# Altium schematic sheet Level_Shifter.SchDoc
size A4; SheetNumber: 9; SheetTotal: 11
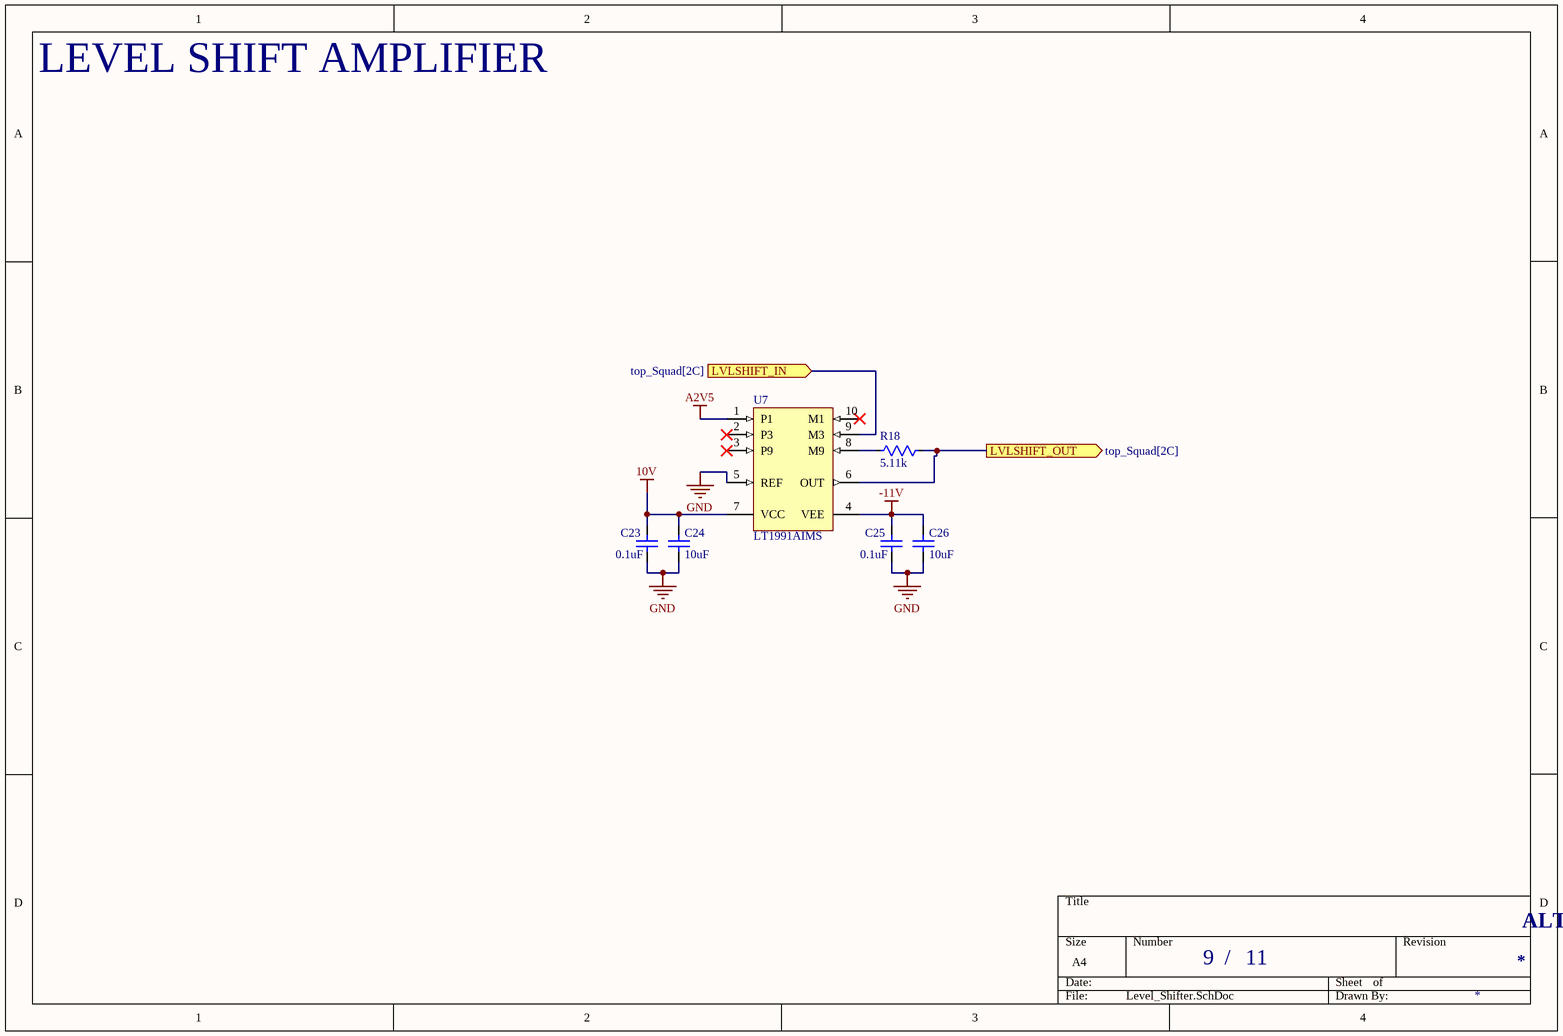
[diagram p0: Level_Shifter.SchDoc]

## Parts
C23  0.1uF  [CAP 0603 NON-IPC KEMET X7R]
C24  10uF  [CAP 0805 IPC MID DENSITY]
C25  0.1uF  [CAP 0603 NON-IPC KEMET X7R]
C26  10uF  [CAP 0805 IPC MID DENSITY]
R18  5.11k  [RES 0402 IPC MID DENSITY]
U7  LT1991AIMS  [10-SOP 0.5MM PITCH 3MM WIDTH IPC HIGH DENSITY]

## Ports
LVLSHIFT_IN (in, see top_Squad[2C]), LVLSHIFT_OUT (out, see top_Squad[2C])

## Nets
10V: C23.2 C24.2 U7.7(VCC)
-11V: C25.2 C26.2 U7.4(VEE)
A2V5: U7.1(P1)
GND: C23.1 C24.1 C25.1 C26.1 U7.5(REF)
LVLSHIFT_IN: U7.9(M3) ; port LVLSHIFT_IN
LVLSHIFT_OUT: R18.2 U7.6(OUT) ; port LVLSHIFT_OUT
NetR18_1: R18.1 U7.8(M9)

Not connected (* = marked no-connect by the designer): U7 2(P3)* 3(P9)* 10(M1)*

## Notes on the sheet
- LEVEL SHIFT AMPLIFIER
- /
- ALTAIR PhotoDiode ReadOut (PDRO) - Squad

## Library data of the parts
C23 C25 = CAP: Kemet C0603C104K5RACAUTO - Cap Ceramic 0.1uF 50V X7R 10% 0603 125C Paper T/R; MF: Kemet; MP: C0603C104K5RACAUTO
C24 C26 = CAP: Murata GRM21BR61E106KA73L - Cap Ceramic 10uF 10% 25V X5R 0805; MF: Murata; MP: GRM21BR61E106KA73L
R18 = RES: Panasonic ERA-2AEB5111X - Res 5.11k 0.1% 1/16W SMD 0402; MF: Panasonic Electronic Components; MP: ERA-2AEB5111X
U7 = LT1991IMS#TRPBF: Programmable Gain Amplifier - Single Channel, Precision, -13 to 14 Gain Selectable Operational Amplifier, 0.56 MHz Typical GBW, 0.12 V/us Typical SR, 2.4 to 40 V, 10-Pin SOP (MS-10), Industial, Pb-Free, Reel; Linear Technology Part Number: LT1991; MF: Linear Technology; Vos (mV) Guaranteed: 0.05; Channels (#): 1; Is (mA) Typical: 0.1; Vs Max (V): 40; Vos (mV) Typical: 0.015; Vs Min (V): 2.4; MP: LT1991AIMS#PBF; GBW (MHz) Typical: 0.56; SR (V/us) Typical: 0.12; ComponentLink1Description: Manufacturer URL; PackageVersion: Rev E; PackageDescription: 10-Lead Plastic MSOP, Body 3 x 3 mm, Pitch 0.5 mm; ComponentLink1URL: http://www.linear.com/; Mounting Technology: Surface Mount; Type: SGA; RoHS: Pb-Free; ComponentLink3URL: http://cds.linear.com/docs/en/packaging/MSOP_10_05-08-1661.pdf; ComponentLink3Description: Package Specification; ComponentLink2Description: Datasheet; DatasheetVersion: Rev. H; ComponentLink2URL: http://cds.linear.com/docs/en/datasheet/1991fh.pdf; Packing: Reel; RevisionNote: URLs updated; PackageReference: LT-MS-10